# Altium schematic sheet 09-WIFI.SchDoc
size A4
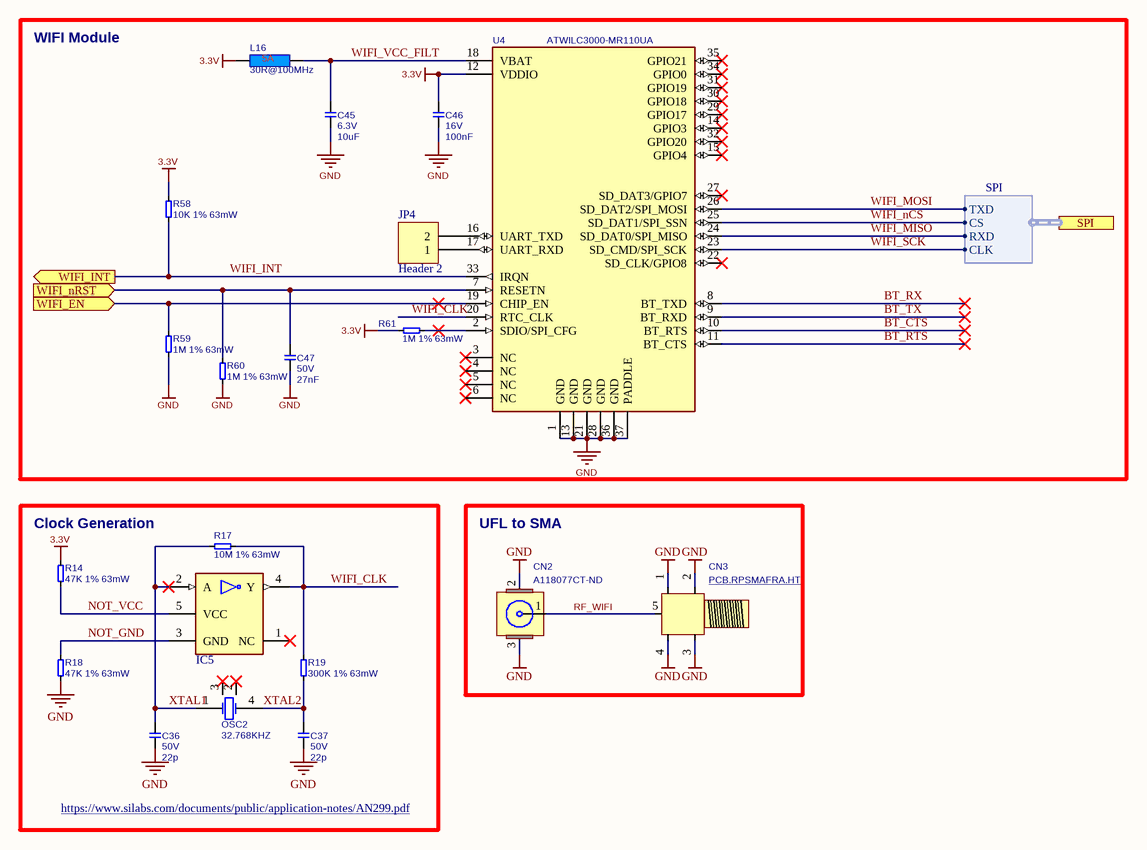
[diagram p0: 09-WIFI.SchDoc]

## Parts
C36  value 22p  Rating: 50V  [T_CAPC0603X33N]  (hidden comment: 22pF 50V 10% C0G)
C37  value 22p  Rating: 50V  [T_CAPC0603X33N]  (hidden comment: 22pF 50V 10% C0G)
C45  value 10uF  Rating: 6.3V  [T_CAPC0603X33N]  (hidden comment: 10uF 6.3V 20% X5R)
C46  value 100nF  Rating: 16V  [CAPC1005X60N]  (hidden comment: 100nF 16V 10% X7R)
C47  value 27nF  Rating: 50V  [T_CAPC0603X33N]  (hidden comment: 27nF 50V 20% X7R)
CN2  A118077CT-ND  [U.FL-R-SMT-1]
CN3  PCB.RPSMAFRA.HT  [0733910320]
IC5  SN74LVC1G04  [SOT65P210X110-5N]  (value not drawn)
JP4  Header 2  [HDR1X2]
L16  value 30R@100MHz  [INDC1608X95N]  (hidden comment: BLM18KG300TN1D)
OSC2  value 32.768KHZ  [OSC_ABRACON_ABS25]  (hidden comment: CRYSTAL 32.7680KHZ 12.5PF SMD)
R14  47K 1% 63mW  [RESC1005X40N]
R17  10M 1% 63mW  [RESC1005X40N]
R18  47K 1% 63mW  [RESC1005X40N]
R19  300K 1% 63mW  [RESC1005X40N]
R58  10K 1% 63mW  [RESC1005X40N]
R59  1M 1% 63mW  [RESC1005X40N]
R60  1M 1% 63mW  [RESC1005X40N]
R61  1M 1% 63mW  [RESC1005X40N]
U4  ATWILC3000-MR110UA  [ATWILC3000-MR110CA]

## Blocks framed on the sheet
WIFI Module: C45-C47 JP4 L16 R58-R61 U4
Clock Generation: C36 C37 IC5 OSC2 R14 R17-R19
UFL to SMA: CN2 CN3

## Ports
SPI (harness SPI), WIFI_EN (in), WIFI_INT (out), WIFI_nRST (in)

## Harnesses
SPI: CS, CLK, RXD, TXD

## Nets
3.3V: C46.2 L16.2 R14.2 R58.2 R61.1 U4.12(VDDIO)
GND: C36.1 C37.1 C45.1 C46.1 C47.1 CN2.2(GND) CN2.3(GND) CN3.1(GND) CN3.2(GND) CN3.3(GND) CN3.4(GND) R18.1 R59.1 R60.1 U4.1(GND) U4.13(GND) U4.21(GND) U4.28(GND) U4.36(GND) U4.37(PADDLE)
BT_CTS: U4.10(BT_RTS)
BT_RTS: U4.11(BT_CTS)
BT_RX: U4.8(BT_TXD)
BT_TX: U4.9(BT_RXD)
NOT_GND: IC5.3(GND) R18.2
NOT_VCC: IC5.5(VCC) R14.1
RF_WIFI: CN2.1(SIG) CN3.5(SIG)
WIFI_CLK: IC5.4(Y) R17.1 R19.2 U4.20(RTC_CLK)
WIFI_EN: R59.2 U4.19(CHIP_EN) ; port WIFI_EN
WIFI_INT: R58.1 U4.33(IRQN) ; port WIFI_INT
WIFI_MISO: U4.24(SD_DAT0/SPI_MISO) ; port SPI.RXD
WIFI_MOSI: U4.26(SD_DAT2/SPI_MOSI) ; port SPI.TXD
WIFI_nCS: U4.25(SD_DAT1/SPI_SSN) ; port SPI.CS
WIFI_nRST: C47.2 R60.2 U4.7(RESETN) ; port WIFI_nRST
WIFI_SCK: U4.23(SD_CMD/SPI_SCK) ; port SPI.CLK
WIFI_VCC_FILT: C45.2 L16.1 U4.18(VBAT)
XTAL1: C36.2 IC5.2(A) OSC2.1(OSC1) R17.2
XTAL2: C37.2 OSC2.4(OSC4) R19.1
NetJP4_1: JP4.1 U4.17(UART_RXD)
NetJP4_2: JP4.2 U4.16(UART_TXD)
NetR61_2: R61.2 U4.2(SDIO/SPI_CFG)

Not connected (* = marked no-connect by the designer): IC5 1(NC)*; OSC2 2* 3*; U4 3(NC)* 4(NC)* 5(NC)* 6(NC)* 14(GPIO3)* 15(GPIO4)* 22(SD_CLK/GPIO8)* 27(SD_DAT3/GPIO7)* 29(GPIO17)* 30(GPIO18)* 31(GPIO19)* 32(GPIO20)* 34(GPIO0)* 35(GPIO21)*

## Notes on the sheet
- https://www.silabs.com/documents/public/application-notes/AN299.pdf
- (in symbol L-Murata-30R@100MHz-5A-0603) 5A

## Library data of the parts
C36 C37 = C-22pF-50V-10%-0603: Capacitor Ceramic C0G 22pF 50V 10% 0603; FP_DESC: C0603; Tolerance: 10%; Type: C0G; Supplier 1: Digi-Key; Supplier Part Number 1: 478-7914-1-ND; MFG: *; MFG_PN: *
C45 = C-10uF-6.3V-20%-0603: Capacitor Ceramic X5R 10uF 6.3V 20% 0603; Type: X7R; FP_DESC: C0603; Tolerance: 20%; Supplier 1: Digi-Key; Supplier Part Number 1: 490-3896-1-ND; MFG: *; MFG_PN: *
C46 = C-100nF-16V-10%-0603: Capacitor Ceramic X7R 100nF 16V 10% 0603; FP_DESC: C0402; Tolerance: 10%; Type: X7R; Supplier 1: Digi-Key; Supplier Part Number 1: 1276-1001-1-ND; Footprint Checked: -; MFG: *; MFG_PN: *
C47 = C-27nF-50V-10%-0603: Capacitor Ceramic X7R 27nF 50V 10% 0603; FP_DESC: C0603; Tolerance: 10%; Type: X7R; Supplier 1: Digi-Key; Supplier Part Number 1: 1276-2025-1-ND; MFG: *; MFG_PN: *
CN2 = CON-TE-A118077CT-ND: U.FL (UMCC) Connector Jack, Male Pin 50Ohm Surface Mount Solder; MFG: TE Connectivity AMP Connectors; FP_DESC: U.FL connector; Symbol Checked: Ok; MFG_PN: A118077CT-ND; Footprint Checked: Assign OK, Footprint OK; Supplier 1: Digi-Key; Supplier Part Number 1: A118077DKR-ND
CN3 = CON-Taoglas-PCB.RPSMAFRA.HT: RP-SMA Conector Jack, clavija macho 50Ohm Orificio pasante, ángulo recto Soldadura; FP_DESC: SMA, Right angle; MFG: Taoglas Limited; Symbol Checked: Ok; MFG_PN: PCB.SMAFRA.HT; Footprint Checked: Assign OK, Footprint OK; Supplier 1: Digi-Key; Supplier Part Number 1: 931-1360-ND
IC5 = IC-TI-SN74LVC1G04: IC INVERTER 1CH 1-INP SC70-5; MFG: Texas Instruments; Supplier 1: Digi-Key; Supplier Part Number 1: 296-11600-1-ND; Footprint Checked: -; MFG_PN: SN74LVC1G04; Symbol Checked: -
JP4 = Header 2: Header, 2-Pin; LatestRevisionDate: 17-Jul-2002; LatestRevisionNote: Re-released for DXP Platform.; Publisher: Altium Limited
L16 = L-Murata-30R@100MHz-5A-0603: 30 Ohms @ 100MHz 1 Power Line Ferrite Bead 0603 (1608 Metric) 5A 10mOhm; Rating: 4A; Tolerance: 25%; MFG: EXC-ML20A390U; Supplier 1: Digi-Key; Supplier Part Number 1: 490-5447-1-ND; Footprint Checked: Ok, Assign Ok; Symbol Checked: -
OSC2 = OSC-ABS25-32.768KHZ-T: 32.768kHz ±20ppm Cristal 12.5pF  4-SOJ, 5.50mm step; MFG: ABRACON; Tolerance: 20ppm; Supplier 1: Digi-Key; Supplier Part Number 1: 535-9166-1-ND; Footprint Checked: -; MFG_PN: ABS25-32.768KHZ-T; Symbol Checked: -
R14 R18 = R-47K-1%-0402: Resistor 47Kohm 63mW 1% 0402; MFG: <GENERIC>; Power: 63mW; Tolerance: 1%; Footprint: R0402; Value: 47K; Supplier 1: Digi-Key; Supplier Part Number 1: 541-47.0KLCT-ND; Footprint Checked: -; MFG_PN: <GENERIC>; Symbol Checked: -
R17 = R-10M-1%-0402: Resistor 10Mohm 63mW 1% 0402; MFG: <GENERIC>; Power: 63mW; Tolerance: 1%; Footprint: R0402; Value: 10M; Supplier 1: Digi-Key; Supplier Part Number 1: 541-10.0MLCT-ND; Footprint Checked: -; MFG_PN: <GENERIC>; Symbol Checked: -
R19 = R-300K-1%-0402: Resistor 300Kohm 63mW 1% 0402; MFG: <GENERIC>; Power: 63mW; Tolerance: 1%; Footprint: R0402; Value: 300K; Supplier 1: Digi-Key; Supplier Part Number 1: 541-4882-1-ND; Footprint Checked: -; MFG_PN: <GENERIC>; Symbol Checked: -
R58 = R-10K-1%-0402: Resistor 10Kohm 63mW 1% 0402; MFG: <GENERIC>; Power: 63mW; Tolerance: 1%; Value: 10k; Footprint: R0402; Supplier 1: Digi-Key; Supplier Part Number 1: 541-10.0KLDKR-ND; Footprint Checked: -; Symbol Checked: -; MFG_PN: <GENERIC>
R59-R61 = R-1M-1%-0402: Resistor 1Mohm 63mW 1% 0402; Manufacturer: <GENERIC>; Replacement Allowed: Yes; Power: 63mW; Tolerance: 1%; Value: 1M; Footprint: R0402; Supplier 1: Digi-Key; Supplier Part Number 1: 541-1.00MLCT-ND; Manufacturer Part Number: <GENERIC>
U4 = IC-Microchip-ATWILC3000: BlueTooth, WiFi 802.11b/g/n, BlueTooth v4.0 Módulos de transceptor RF 2.4GHz Antena no incluida, U.FL Montaje en superficie; FP_DESC: ATWILC3000-MR110CA Module; Symbol Checked: M; Footprint Checked: -; MFG: MICROCHIP; MFG_PN: ATWILC3000-MR110UA; Supplier 1: Digi-Key; Supplier Part Number 1: ATWILC3000-MR110UA-ND